# EAGLE schematic user_prog_jig_pcb v64 (EAGLE 9.7.0)
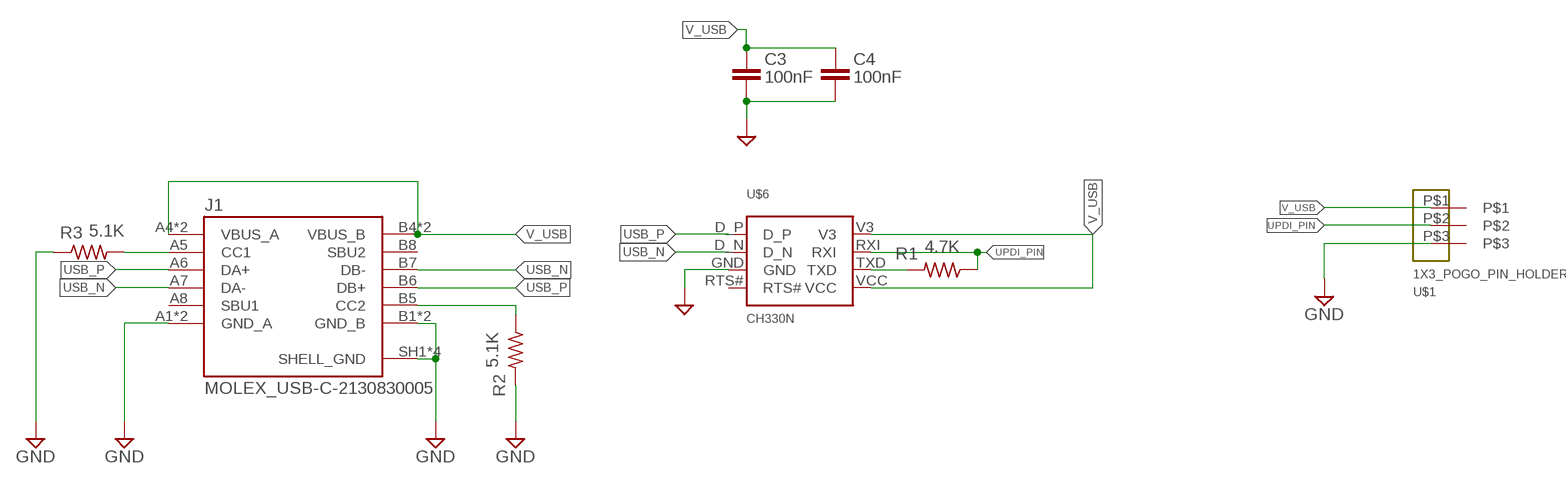
[diagram p0: schematic, sheet 1]

## Parts
C3  100nF  C_CHIP-0402(1005-METRIC)  [CAPC1005X60]
C4  100nF  C_CHIP-0402(1005-METRIC)  [CAPC1005X60]
J1  MOLEX_USB-C-2130830005  [MOLEX_2130830005]
R1  4.7K  R-US_CHIP-0402(1005-METRIC)  [RESC1005X40]
R2  5.1K  R-US_CHIP-0402(1005-METRIC)  [RESC1005X40]
R3  5.1K  R-US_CHIP-0402(1005-METRIC)  [RESC1005X40]
U$1  1X3_POGO_PIN_HOLDER  [1X3_POGO_PIN_HOLDER]
U$6  CH330N  [CH330N]

## Nets
CC1: J1.A5(CC1) R3.2
CC2: J1.B5(CC2) R2.1
GND: C3.2 C4.2 J1.A1(GND_A) J1.A12(GND_A) J1.B1(GND_B) J1.B12(GND_B) J1.SH1(SHELL_GND) J1.SH2(SHELL_GND) J1.SH3(SHELL_GND) J1.SH4(SHELL_GND) R2.2 R3.1 U$1.P$3 U$6.GND
N$4: R1.2 U$6.TXD
UPDI_PIN: R1.1 U$1.P$2 U$6.RXI
USB_N: J1.A7(DA-) J1.B7(DB-) U$6.D_N
USB_P: J1.A6(DA+) J1.B6(DB+) U$6.D_P
V_USB: C3.1 C4.1 J1.A4(VBUS_A) J1.A9(VBUS_A) J1.B4(VBUS_B) J1.B9(VBUS_B) U$1.P$1 U$6.V3 U$6.VCC
Unconnected: J1.A8(SBU1) J1.B8(SBU2) U$6.RTS#

## Library data of the parts
C3 C4 = MY_CAP_LIB:C: Capacitor - Generic; CATEGORY: Capacitor
J1 = MY_CLOCK_LIB_COMPONENTS:MOLEX_USB-C-2130830005: USB-C (USB TYPE-C) USB 2.0 Receptacle Connector 24 (16+8 Dummy) Position Surface Mount, Right Angle; Through Hole; MANUFACTURER: Molex; MAXIMUM_PACKAGE_HEIGHT: 3.36mm; PARTREV: A; STANDARD: Manufacturer recommendations
R1-R3 = resistor:R-US: Resistor Fixed - ANSI; CATEGORY: Resistor; SUB-CATEGORY: Fixed
U$1 = MY_CLOCK_LIB_COMPONENTS:1X3_POGO_PIN_HOLDER
U$6 = MY_CLOCK_LIB_COMPONENTS:CH330N